# EAGLE board stm32_tracker34 (EAGLE 8.6.3)
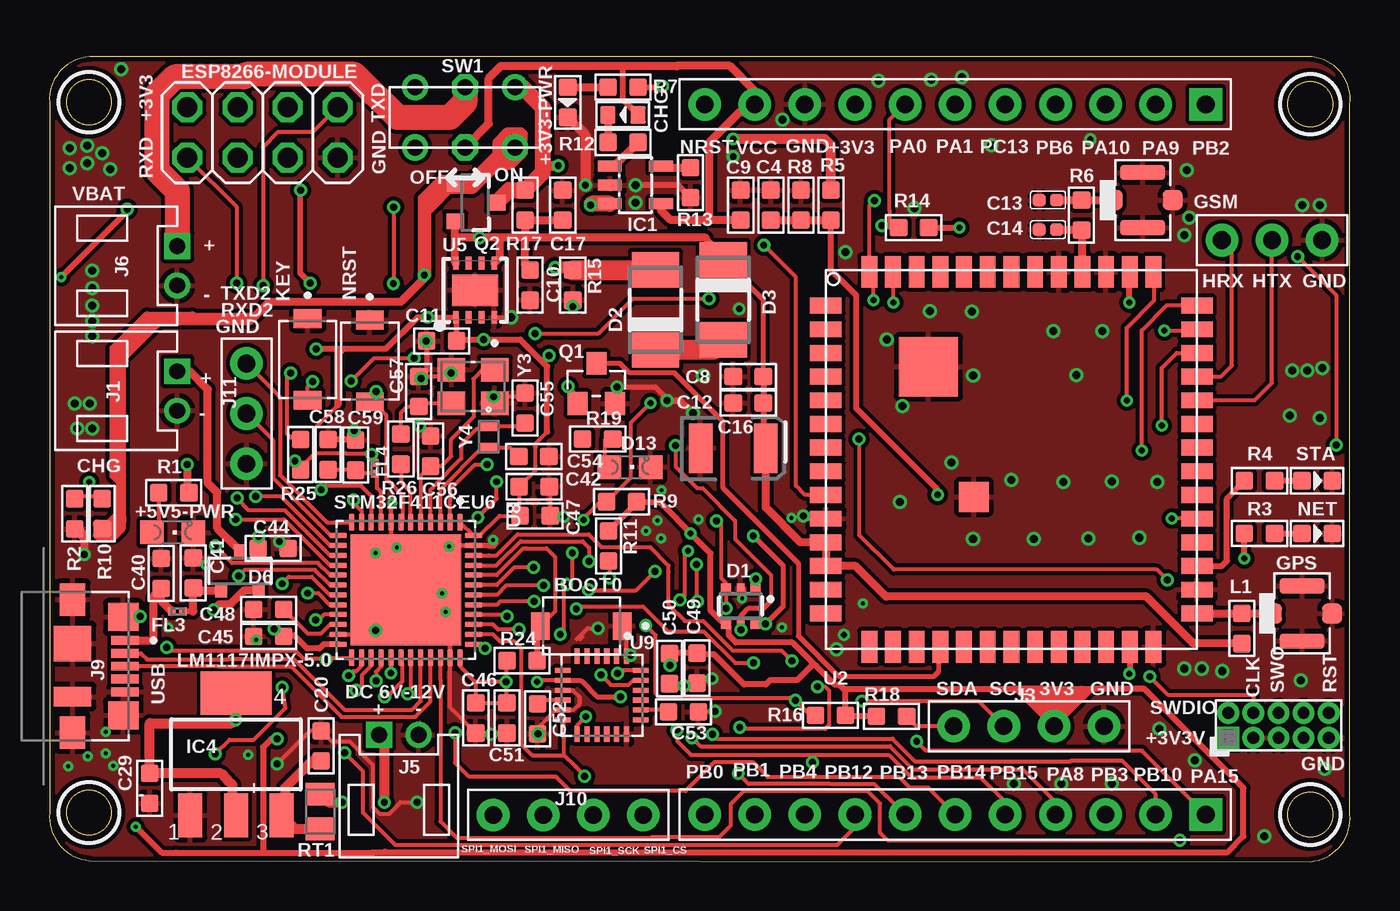
[diagram p1: board, top side]
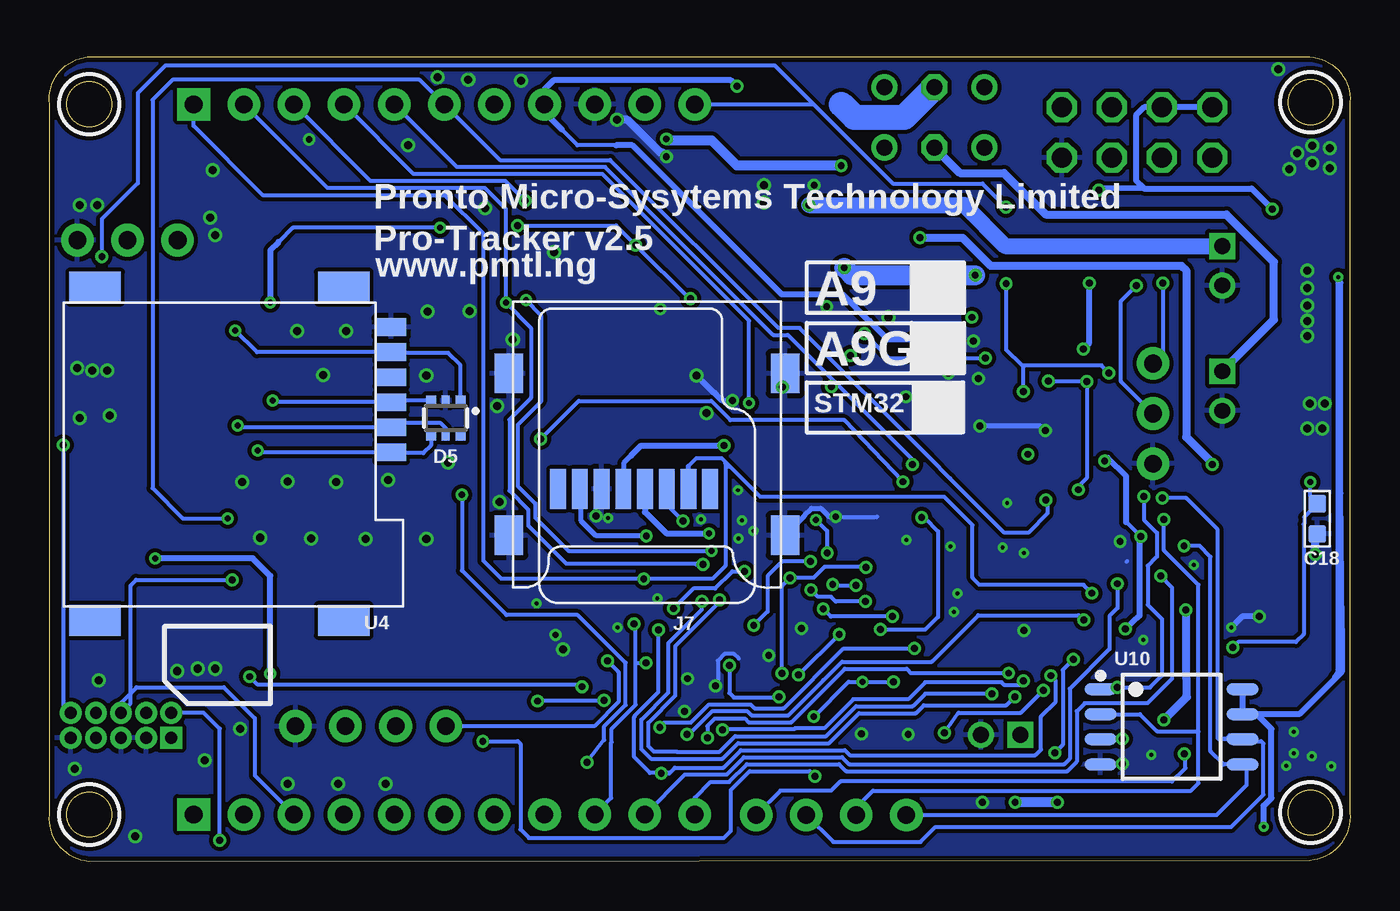
[diagram p2: board, bottom side, seen from below]

Size 65.92 x 40.79 mm. Coordinates in mm from the lower left corner, seen from the top.
Outline: 0.01,38.48 0.01,2.48 arc90 2.03,0.05 63.93,0 arc90 65.91,2.38 65.91,38.38 arc90 64.01,40.79 2.03,40.79 arc90 0.01,38.48
Outline: circle at 63.91,2.38 radius 1.14
Outline: circle at 63.91,38.38 radius 1.14
Outline: circle at 2.01,2.48 radius 1.14
Outline: circle at 2.01,38.48 radius 1.14
Copper layers (1*16): Top 0.035mm / dielectric 1.5mm / Bottom 0.035mm
Design rules "default": minimum track width 6mil, minimum drill 10mil, track to track 6mil, track to pad 6mil, pad to pad 6mil, via to via 6mil, smd to smd 0mil, copper to edge 10mil, drill to drill 10mil, minimum pad ring 10mil, minimum via ring 6mil, stop-mask expansion 2mil, vias tented up to drill 100mil, thermal gap 10mil
Net classes: 0 default: width 0.203 mm, drill 0.305 mm, clearance 0.152 mm; 2 gnd: width 0.305 mm, drill 0.559 mm, clearance 0.254 mm; 3 usbvcc: width 0.508 mm, drill 0.61 mm, clearance 0.254 mm; 4 USBpair: width 0.254 mm, drill 0.406 mm, clearance 0.406 mm
tRestrict: area 62.4,0.9 to 65.4,3.9; area 62.4,36.9 to 65.4,39.9; area 0.5,1 to 3.5,4; area 0.5,37 to 3.5,40
bRestrict: area 62.4,0.9 to 65.4,3.9; area 62.4,36.9 to 65.4,39.9; area 0.5,1 to 3.5,4; area 0.5,37 to 3.5,40

## Footprints (pad centres in the part's own frame; a part is rotated, then mirrored left to right if it is on the bottom)
LED-0603 = smd 0.889 x 0.889: + -0.762,0; - 0.762,0
OPTO_CHIPLED_0805 = smd 1.2 x 1.2: A 0,-1.05; C 0,1.05
SW_TL1015AF160QG = smd 0.95 x 1.4: 1 -2.075,0; 2 2.075,0
C0603 = smd 0.889 x 0.889: 1 -0.762,0; 2 0.762,0
C0402 = smd 0.635 x 0.635: 1 -0.445,0; 2 0.445,0
EIA3528 = smd 1.2 x 2.5: A 1.65,0; C -1.65,0
D0603 = smd 0.762 x 0.889: + -0.762,0; - 0.762,0
PINHEAD_2X05_127 = drill 0.6 pad 1.016 square: 1 -0.635,2.54 | drill 0.6 pad 1.016: 2 0.635,2.54; 3 -0.635,1.27; 4 0.635,1.27; 5 -0.635,0; 6 0.635,0; 7 -0.635,-1.27; 8 0.635,-1.27; 9 -0.635,-2.54; 10 0.635,-2.54
SOT363 = smd 0.5 x 0.5: 1 -0.75,-0.9; 3 0.75,-0.9; 4 0.75,0.9; 6 -0.75,0.9 | smd 0.4 x 0.5: 2 0,-0.9; 5 0,0.9
DO-214AC = smd 1.8 x 2.4: A 2.025,0; C -2.025,0
SOT23-R = smd 0.6 x 0.7: 1 -0.95,-1; 2 0.95,-1; 3 0,1
2X04 = drill 1.016 octagon: 1 -3.81,-1.27; 2 -3.81,1.27; 3 -1.27,-1.27; 4 -1.27,1.27; 5 1.27,-1.27; 6 1.27,1.27; 7 3.81,-1.27; 8 3.81,1.27
BEADC0603X33N = smd 0.38 x 0.4: 1 -0.281,0; 2 0.281,0
4P-U-FL = smd 1.016 x 1.016: D -1.524,0; GND3 1.524,0 | smd 2.286 x 0.762: GND1 0,1.397; GND2 0,-1.397
SOT23-5L = smd 0.55 x 1.2: 1 -0.95,-1.3; 2 0,-1.3; 3 0.95,-1.3; 4 0.95,1.3; 5 -0.95,1.3
INTEGRATEDCIRCUITS_LINEAR_SOT223 = smd 1.219 x 2.235: 1 -2.311,-3.099; 2 0,-3.099; 3 2.311,-3.099 | smd 3.6 x 2.2: 4 0,3.099
PH2.0-2P-90-DIP = drill 0.8 square: 1 0,1 | drill 0.8: 2 0,-1
11P-2.54 = drill 0.889 pad 1.651 square: 1 0,12.7 | drill 0.889 pad 1.651: 2 0,10.16; 3 0,7.62; 4 0,5.08; 5 0,2.54; 6 0,0; 7 0,-2.54; 8 0,-5.08; 9 0,-7.62; 10 0,-10.16; 11 0,-12.7
4P-65/35ROUND = drill 0.889 pad 1.651: 1 0,3.81; 2 0,1.27; 3 0,-1.27; 4 0,-3.81
3P-2.54 = drill 0.9 pad 1.651: 1 0,2.54; 2 0,0; 3 0,-2.54
8P-SMD = smd 0.8 x 2.008: 1 -3.198,0.254; 2 -2.098,0.254; 3 -0.998,0.254; 4 0.102,0.254; 5 1.202,0.254; 6 2.302,0.254; 7 3.402,0.254; 8 4.502,0.254 | smd 1.45 x 2: 9 -7.002,2.6; 10 7.002,2.6; 11 -7.002,-5.598; 12 7.002,-5.598
MOLEX_47346-0001 = smd 0.45 x 1.38: 1 -1.3,2.66; 2 -0.65,2.66; 3 0,2.66; 4 0.65,2.66; 5 1.3,2.66 | smd 1.425 x 1.55: S1 -2.487,2.575; S2 2.487,2.575 | smd 1.65 x 1.3: S3 -3.375,0; S6 3.375,0 | smd 1.8 x 1.9: S4 -1.15,0 | smd 1 x 1.9: S5 1.55,0
L0603 = smd 0.889 x 0.889: 1 -0.762,0; 2 0.762,0
SOT23@1 = smd 1.016 x 1.143: 1 -0.95,-1.016; 2 0.95,-1.016; 3 0,1.016
SOT23-3 = smd 0.8 x 0.9: 1 -0.95,-1; 2 0.95,-1; 3 0,1.1
R0603 = smd 0.889 x 0.889: 1 -0.762,0; 2 0.762,0
THRMC2012X110N = smd 1.15 x 1.47: 1 -0.88,0; 2 0.88,0
6P-2CH-2.54-7.6X3.0 = drill 0.813 pad 1.27: CH1A -1.524,2.54; CH1B -1.524,-2.54; CH2A 1.524,2.54; CH2B 1.524,-2.54 | drill 0.813 pad 1.27 octagon: COM1 -1.524,0; COM2 1.524,0
A9G = smd 1.6 x 0.8: 1 -9.4,7.8; 2 -9.4,6.6; 3 -9.4,5.4; 4 -9.4,4.2; 5 -9.4,3; 6 -9.4,1.8; 7 -9.4,0.6; 8 -9.4,-0.6; 9 -9.4,-1.8; 10 -9.4,-3; 11 -9.4,-4.2; 12 -9.4,-5.4; 13 -9.4,-6.6; 14 -9.4,-7.8; 28 9.4,-7.8; 29 9.4,-6.6; 30 9.4,-5.4; 31 9.4,-4.2; 32 9.4,-3; 33 9.4,-1.8; 34 9.4,-0.6; 35 9.4,0.6; 36 9.4,1.8; 37 9.4,3; 38 9.4,4.2; 39 9.4,5.4; 40 9.4,6.6; 41 9.4,7.8 | smd 0.8 x 1.6: 15 -7.2,-9.5; 16 -6,-9.5; 17 -4.8,-9.5; 18 -3.6,-9.5; 19 -2.4,-9.5; 20 -1.2,-9.5; 21 0,-9.5; 22 1.2,-9.5; 23 2.4,-9.5; 24 3.6,-9.5; 25 4.8,-9.5; 26 6,-9.5; 27 7.2,-9.5; 42 7.2,9.5; 43 6,9.5; 44 4.8,9.5; 45 3.6,9.5; 46 2.4,9.5; 47 1.2,9.5; 48 0,9.5; 49 -1.2,9.5; 50 -2.4,9.5; 51 -3.6,9.5; 52 -4.8,9.5; 53 -6,9.5; 54 -7.2,9.5 | smd 3 x 3: 55 -4.2,4.7 | smd 1.5 x 1.5: 56 -1.9,-1.9
MICROSIM = smd 1.5 x 0.9: 1 -0.8,2.5; 2 -0.8,5.04; 3 -0.8,7.58; 5 -0.8,1.23; 6 -0.8,3.77; 7 -0.8,6.31 | smd 2.61 x 1.56: P$1 1.6,-0.8; P$2 14.2,-0.8; P$3 14.2,16.1; P$4 1.6,16.1
8-UDFN = smd 0.3 x 0.65: 1 -0.975,-1.375; 2 -0.325,-1.375; 3 0.325,-1.375; 4 0.975,-1.375; 5 0.975,1.375; 6 0.325,1.375; 7 -0.325,1.375; 8 -0.975,1.375 | smd 2.35 x 1.6: EP 0,0
QFN50P700X700X60-49N = smd 0.87 x 0.27: 1 -3.43,2.75; 2 -3.43,2.25; 3 -3.43,1.75; 4 -3.43,1.25; 5 -3.43,0.75; 6 -3.43,0.25; 7 -3.43,-0.25; 8 -3.43,-0.75; 9 -3.43,-1.25; 10 -3.43,-1.75; 11 -3.43,-2.25; 12 -3.43,-2.75; 25 3.43,-2.75; 26 3.43,-2.25; 27 3.43,-1.75; 28 3.43,-1.25; 29 3.43,-0.75; 30 3.43,-0.25; 31 3.43,0.25; 32 3.43,0.75; 33 3.43,1.25; 34 3.43,1.75; 35 3.43,2.25; 36 3.43,2.75 | smd 0.27 x 0.87: 13 -2.75,-3.43; 14 -2.25,-3.43; 15 -1.75,-3.43; 16 -1.25,-3.43; 17 -0.75,-3.43; 18 -0.25,-3.43; 19 0.25,-3.43; 20 0.75,-3.43; 21 1.25,-3.43; 22 1.75,-3.43; 23 2.25,-3.43; 24 2.75,-3.43; 37 2.75,3.43; 38 2.25,3.43; 39 1.75,3.43; 40 1.25,3.43; 41 0.75,3.43; 42 0.25,3.43; 43 -0.25,3.43; 44 -0.75,3.43; 45 -1.25,3.43; 46 -1.75,3.43; 47 -2.25,3.43; 48 -2.75,3.43 | smd 5.6 x 5.6: 49 0,0
QFN50P400X400X95-24N = smd 0.79 x 0.26: 1 -1.97,1.25; 2 -1.97,0.75; 3 -1.97,0.25; 4 -1.97,-0.25; 5 -1.97,-0.75; 6 -1.97,-1.25; 13 1.97,-1.25; 14 1.97,-0.75; 15 1.97,-0.25; 16 1.97,0.25; 17 1.97,0.75; 18 1.97,1.25 | smd 0.26 x 0.79: 7 -1.25,-1.97; 8 -0.75,-1.97; 9 -0.25,-1.97; 10 0.25,-1.97; 11 0.75,-1.97; 12 1.25,-1.97; 19 1.25,1.97; 20 0.75,1.97; 21 0.25,1.97; 22 -0.25,1.97; 23 -0.75,1.97; 24 -1.25,1.97
SOIC127P790X216-8N = smd 1.6 x 0.6: 1 -3.6,1.905; 2 -3.6,0.635; 3 -3.6,-0.635; 4 -3.6,-1.905; 5 3.6,-1.905; 6 3.6,-0.635; 7 3.6,0.635; 8 3.6,1.905
XTAL_7M25072001 = smd 1.2 x 1.4: 1 -0.85,1.1; 2 -0.85,-1.1; 3 0.85,-1.1; 4 0.85,1.1
XTAL160X100X50 = smd 0.5 x 1: 1 -0.55,0; 2 0.55,0

## Placement (x,y rotation side)
+3V3-PWR  RED  [LED-0603]  26.27,38.48 270 top
+5V5-PWR  RED  [OPTO_CHIPLED_0805]  6.26,16.69 270 top
BOOT0  TL1015AF160QG  [SW_TL1015AF160QG]  26.96,11.94 180 top
C4  0.1uF  [C0603]  36.56,33.27 90 top
C8  10uF  [C0603]  35.42,24.59 0 top
C9  10u  [C0603]  35.04,33.27 270 top
C10  4.7uF  [C0603]  24.37,29.21 90 top
C11  4.7uF  [C0603]  19.87,26.39 0 top
C12  1uF  [C0603]  35.42,23.24 0 top
C13  NC  [C0402]  50.61,33.53 0 top
C14  NC  [C0402]  50.61,32.03 0 top
C16  100uF  [EIA3528]  34.65,20.96 0 top
C17  10uF  [C0603]  26.02,33.27 270 top
C18  0.1uF  [C0603]  1.66,17.37 270 bottom
C20  100nF  [C0603]  13.78,5.87 270 top
C29  100nF  [C0603]  5.09,3.71 270 top
C40  100nF  [C0603]  5.67,14.61 270 top
C41  100nF  [C0603]  7.3,14.63 270 top
C42  2.2uF  [C0603]  24.57,19 180 top
C44  100nF  [C0603]  11.34,15.86 180 top
C45  100nF  [C0603]  11.11,11.4 0 top
C46  100nF  [C0603]  21.61,7.28 90 top
C47  100nF  [C0603]  24.62,17.53 180 top
C48  2.2uF  [C0603]  11.11,12.78 0 top
C49  100nF  [C0603]  32.83,9.8 90 top
C50  100nF  [C0603]  31.43,9.78 90 top
C51  100nF  [C0603]  23.19,7.28 90 top
C52  0.1uf  [C0603]  24.74,7.24 90 top
C53  220pf  [C0603]  32.14,7.59 180 top
C54  4.3pf  [C0603]  24.55,20.52 180 top
C55  4.3pf  [C0603]  24.11,22.99 270 top
C56  12pf  [C0603]  19.31,20.8 270 top
C57  12pf  [C0603]  18.72,23.83 270 top
C58  100nF  [C0603]  14.13,20.62 270 top
C59  100nF  [C0603]  15.53,20.6 270 top
CHG  ORANGE  [D0603]  29.07,37.85 180 top
CN2  PINHEAD-2x5-P1.27  [PINHEAD_2X05_127]  62.29,6.91 90 top
D1  SMF05C  [SOT363]  35.04,12.95 180 top
D2  S2M  [DO-214AC]  30.72,27.97 90 top
D3  SS34  [DO-214AC]  34.15,28.47 270 top
D5  SMF05C  [SOT363]  45.83,22.48 180 bottom
D6  BAT54C  [SOT23-R]  9.66,14.73 0 top
D13  Yellow  [OPTO_CHIPLED_0805]  29.42,19.99 270 top
ESP8266-MODULE  [2X04]  10.8,36.96 0 top
FL3  BLM03AG100SZ1D  [BEADC0603X33N]  6.49,12.67 0 top
FL4  BLM03AG100SZ1D  [BEADC0603X33N]  16.49,19.94 270 top
GPS  [4P-U-FL]  63.48,12.57 0 top
GSM  [4P-U-FL]  55.41,33.53 0 top
IC1  MCP73831/OT  [SOT23-5L]  29.7,34.29 270 top
IC4  LM1117IMPX-5.0  [INTEGRATEDCIRCUITS_LINEAR_SOT223]  9.46,5.44 0 top
J1  PH2.0-2P-90-DIP  [PH2.0-2P-90-DIP]  6.49,23.85 0 top
J2  [11P-2.54]  45.91,38.38 270 top
J3  [4P-65/35ROUND]  49.64,6.86 90 top
J4  [3P-2.54]  61.96,31.5 90 top
J5  PH2.0-2P-90-DIP  [PH2.0-2P-90-DIP]  17.71,6.43 90 top
J6  PH2.0-2P-90-DIP  [PH2.0-2P-90-DIP]  6.49,30.2 0 top
J7  [8P-SMD]  35.63,19.14 180 bottom
J8  [11P-2.54]  45.91,2.38 270 top
J9  47346-0001  [MOLEX_47346-0001]  1.18,9.91 270 top
J10  [4P-65/35ROUND]  26.3,2.36 270 top
J11  [3P-2.54]  9.99,22.71 0 top
KEY  TL1015AF160QG  [SW_TL1015AF160QG]  13.09,25.45 270 top
L1  82nH  [L0603]  60.44,11.81 270 top
NET  Blue  [LED-0603]  64.25,16.64 0 top
NRST  TL1015AF160QG  [SW_TL1015AF160QG]  16.24,25.37 270 top
Q1  BSN20  [SOT23@1]  27.72,24.23 0 top
Q2  MOSFET-PCHANNEL  [SOT23-3]  21.57,33.4 270 top
R1  1K  [R0603]  6.31,18.69 0 top
R2  1M  [R0603]  1.28,17.63 90 top
R3  330R  [R0603]  61.32,16.64 0 top
R4  330R  [R0603]  61.32,19.3 0 top
R5  1M/1%  [R0603]  39.61,33.27 90 top
R6  0R  [R0603]  52.31,32.77 90 top
R7  1K  [R0603]  29.07,39.24 180 top
R8  1M/1%  [R0603]  38.08,33.27 270 top
R9  2k2  [R0603]  28.99,18.24 180 top
R10  1M  [R0603]  2.68,17.63 270 top
R11  2k2  [R0603]  28.33,16 270 top
R12  1k  [R0603]  29.07,36.45 0 top
R13  2k  [R0603]  32.5,34.42 270 top
R14  10k  [R0603]  43.8,32.13 0 top
R15  100k  [R0603]  26.53,29.21 270 top
R16  2k2  [R0603]  39.58,7.42 180 top
R17  NC  [R0603]  24.11,33.27 270 top
R18  2k2  [R0603]  42.68,7.37 0 top
R19  1K  [R0603]  27.79,21.41 180 top
R24  1K  [R0603]  23.96,10.19 0 top
R25  1K  [R0603]  12.73,20.62 90 top
R26  0R  [R0603]  17.81,20.9 90 top
RT1  PRG21BC1R0MM1RA  [THRMC2012X110N]  13.73,2.54 90 top
STA  green  [LED-0603]  64.25,19.3 0 top
SW1  [6P-2CH-2.54-7.6X3.0]  21.07,37.72 270 top
U2  [A9G]  48.75,20.38 0 top
U4  MICROSIM  [MICROSIM]  49.4,28.32 180 bottom
U5  AP7361C-33FGE  [8-UDFN]  21.57,28.96 0 top
U8  STM32F411CEU6  [QFN50P700X700X60-49N]  18.07,13.77 270 top
U9  MPU-6050  [QFN50P400X400X95-24N]  28,8.43 270 top
U10  W25Q32JVSSIQ  [SOIC127P790X216-8N]  9.05,6.83 0 bottom
Y3  7M25072001  [XTAL_7M25072001]  21.47,24.08 270 top
Y4  32.768KHZ  [XTAL160X100X50]  22.27,21.53 270 top

## Tracks (layer width: path | path; a pad name or v marks a point on that pad's centre or on a via)
+3V3  (via drill 0.2, 0.3, 0.35)
  Top 0.203: 29.75,18.16 29.64,18.05 29.61,18.05 R11.1 | 29.75,18.16 29.96,18.16 31,18.16 31.11,18.05 | 29.75,18.16 R9.1 | C50.2 31.43,9.97 v31.45,9.94 | v28.94,8.36 28.94,8.1 | 23.02,8.04 C46.2 21.61,9.09 | 23.02,8.04 C51.2 | 23.15,10.18 23.08,10.25 | 22.9,10.34 23.05,10.34 R24.1 23.15,10.13 v23.15,9.12 | v23.15,9.12 23.15,8.17 23.02,8.04 | v23.15,9.12 21.63,9.12 21.61,9.09 | 21.61,9.09 20.82,9.89 U8.36 | 12.39,11.48 11.95,11.48 C45.2 | 24.62,21.01 24.64,21.04 | 24.62,21.01 24.62,19.81 C42.2 23.81,17.48 C47.2 22.81,17.53 21.8,16.52 U8.48 U8.1 | 24.62,21.01 24.62,21.17 25.23,21.78 | U9.13 26.75,6.91 v27.18,7.35 | U9.8 24.78,9.18 v24.72,9.12 | 38.86,9.92 38.62,9.92 | v16.34,20.64 16.35,20.65 16.36,20.66 15.04,20.66 15.02,20.69 13.45,20.69 | 13.45,20.69 13.45,20.89 13.43,20.9 13.43,21.94 14.59,23.1 | 13.45,20.69 12.73,19.98 R25.1 12.73,20.01 v12.44,20.3
  Top 0.254: U9.8 26.94,9.18 27.77,8.36 v28.94,8.36
  Top 0.279: C11.2 20.63,27.55 U5.1 v19.16,27.58 | v13.22,29.31 12.71,29.82 12.71,34.04 v12.73,34.04
  Top 0.305: 40.24,8.76 49.01,8.76 | 49.01,8.76 49.26,8.76 | 50.91,8.76 52.31,8.76 | 52.31,8.76 52.82,8.76 | J3.3 50.91,8.76 | 50.91,8.76 49.26,8.76 | 49.26,8.76 49.26,8.51 | 49.26,8.51 J3.3 | J3.3 52.31,8.25 | 52.31,8.25 52.31,8.64 | 52.31,8.76 52.31,8.64 | 52.31,8.64 51.04,7.37 50.91,7.37 50.78,7.24 50.78,7.37 49.51,8.64 51.93,8.64 52.05,8.51 51.8,8.51 51.04,7.75 50.66,7.75 50.66,7.87 50.02,8.51 51.42,8.51 51.55,8.38 51.42,8.38 51.29,8.25 | 51.29,8.25 51.04,8 50.78,8 50.4,8.38 51.16,8.38 51.29,8.25 | 52.82,8.76 52.31,8.25 | 49.01,8.76 49.26,8.51 | 58.83,5.41 60.51,3.73 60.51,1.27 59.69,0.45 17.05,0.45 | 58.83,5.41 55.48,8.76 52.82,8.76 | v19.16,27.58 18.65,27.58 17.05,25.98 14.89,25.98 | 14.89,25.98 14.59,25.98 | 14.59,25.98 v13.52,25.98 | v11.55,6.21 11.24,6.2 10.83,5.79 10.83,0.48 10.8,0.45 | U8.24 13.91,11.02 13.69,10.8 13.06,10.8 12.39,11.48 | R25.1 12.76,19.84 | C50.2 31.45,10.57 C49.2 32.88,10.52 33.66,10.52 35.21,8.97 36.31,8.97 36.53,9.19 37.89,9.19 38.62,9.92 | 40.24,8.76 40.34,8.66 R16.1 40.39,7.37 R18.1 | C11.2 20.71,26.47 v22.01,26.47 23.86,26.47 25,25.32 | R7.1 31.02,39.24 v31.07,39.29 | 23.08,10.25 R24.1 | CN2.1 58.89,5.41 58.83,5.41 | 40.24,8.76 40.04,8.97 39.81,8.97 38.86,9.92 37.67,11.11 34.79,11.11 34.42,11.48 34.42,11.92 D1.4 34.15,12.19 34.04,12.19 33.51,12.72 33.51,15.62 v32.5,16.64 32.5,16.66 31.11,18.05 30.92,18.24 R9.1 | v3.95,33.07 3.95,32.97 v0.59,29.62 | C45.2 11.4,11.87 v11.4,11.8 | C44.2 10.58,16.44 v10.61,16.48 | 14.89,25.98 14.66,25.76 14.66,23.18 14.59,23.1 14.59,25.98 | 25.23,21.78 25.23,25.09 25,25.32 | R11.1 29.73,18.16 29.96,18.16 | 25,25.32 v25.32,25.65 | 17.05,0.45 16.49,0.45
  Top 0.305: 16.49,0.45 16.34,0.45 | 17.05,0.45 17,0.5 | 10.8,0.45 6.41,0.45 5.7,0.45 v4.38,1.77 | 10.8,0.45 16.49,0.45 | FL4.1 16.35,20.36 16.35,20.65
  Bottom 0.203: v31.45,9.94 31.45,8.55 31.23,8.32 28.98,8.32 v28.94,8.36 | 39.95,37.1 39.16,36.31 37.19,36.31 | 10.67,16.53 11.34,17.21 11.35,17.21 | v27.18,7.35 25.41,9.12 v24.72,9.12 v23.15,9.12
  Bottom 0.254: 35.8,18.82 J7.4 | v12.44,20.3 12.29,20.45 12.29,20.46
  Bottom 0.279: v12.73,34.04 12.65,34.12 10.46,34.12
  Bottom 0.305: J7.4 35.73,17.72 34.65,16.64 v32.5,16.64 | v3.95,33.07 4.99,34.11 10.45,34.11 10.46,34.12 10.85,34.52 10.85,37.82 10.45,38.23 ESP8266-MODULE.4 ESP8266-MODULE.2 | 0.43,11.81 0.42,9.9 0.76,9.35 | 0.43,11.81 0.49,18.67 0.49,29.34 0.59,29.44 v0.59,29.62 0.59,9.45 | v13.52,25.98 13.22,26.29 v13.22,29.31 | U10.8 U10.7 4.78,7.47 4.76,7.49 | U10.3 v11.55,6.21 | v22.01,26.47 23.42,26.47 24.36,27.4 24.39,27.4 25.74,28.75 28.81,28.75 36.37,36.31 37.19,36.31 | v31.07,39.29 31.38,39.6 40.37,39.6 40.83,39.14 J2.8 40.83,37.97 39.95,37.1 | v4.38,1.77 4.38,2.83 3.99,3.22 3.99,6.73 4.76,7.49 | 4.76,7.49 2.55,7.49 0.59,9.45 | 0.43,11.81 0.43,9.61 0.59,9.45 | v11.4,11.8 10.67,12.47 10.67,16.53 v10.61,16.48 | 12.29,20.46 11.35,19.52 11.35,17.21
+5V  (via drill 0.35)
  Top 0.406: v8.32,12.75 8.6,13.03 9.16,13.03 9.86,13.73 D6.2
  Top 0.508: IC4.4 9.46,7.21 v9.43,7.19 9.26,7.01 5.09,7.01 C29.1 8.7,4.47 9.02,4.15 9.28,3.89 9.28,2.51 IC4.2
  Bottom 0.406: v9.43,7.19 8.27,8.34 8.31,8.38 8.31,9.32 8.32,9.34 v8.32,12.75
A9_RESET
  Top 0.254: U2.18 45.07,10.8 45.07,9.65 44.81,9.4 39.99,9.4 37.96,11.43 37.96,15.11 34.15,18.92 34.15,22.3 31.69,24.76 29.4,24.76 28.92,25.25 Q1.3
BOOT0
  Top 0.203: 25.16,11.66 BOOT0.2 25.63,12.69 25.63,15.43 25.19,15.88 24.17,15.88 24.16,15.86 24.02,15.86 22.67,14.52 U8.44
  Top 0.305: BOOT0.2 24.72,11.78 R24.2
CPOUT
  Top 0.203: C53.2 31.29,7.68 U9.20
GND  (via drill 0.2, 0.3, 0.35, 0.41)
  Top 0.127: v27.81,11.82 27.87,11.89
  Top 0.203: Q1.2 28.67,23.96 v28.76,24.06 | 24.06,23.67 C55.1 23.92,23.56 v22.51,23.56 | 18.91,24.74 19.08,24.92 19.08,24.79 C57.1 | 29.22,11.63 29.22,10.52 U9.1 29.36,10.45 v29.46,10.45 | U8.8 17.31,17.27 17.31,18.11 v17.38,18.19 17.32,18.12 U8.8 | 17.31,17.09 U8.8 | C44.1 11.98,16.22 v11.66,16.22 | 10.16,12.72 10.23,12.79 | v18.63,3.01 17.8,3.01 17.22,2.43 16.74,2.43 16.39,2.77 16.39,4.91 15.21,6.09 14.31,6.09 C20.1 13.22,6.63 v11.54,4.95 | v32.17,8.9 32.68,8.9 C49.1 33.05,9.27 v33.59,9.27 | U8.49 18.96,13.77 | 19.72,13.77 v19.9,13.59 | U8.49 17.31,14.53 | U8.49 18.07,13.95 | 20.32,16.02 22.53,16.02 22.64,16.13 v22.49,16.3 | v26.07,17.48 26.02,17.53 C47.1 25.38,18.95 C42.1 | U8.8 17.32,16.22 v17.61,15.93 | C53.1 32.92,7.61 v33.74,7.61 | 28.96,11.38 29.22,11.63 | BOOT0.1 29.03,11.82 29.22,11.63 | 27.01,11.38 26.91,11.28 | Y3.2 20.03,24.59 C57.1 | v23.4,27.58 U5.4 | 20.37,25.13 v20.37,24.75 | C57.1 18.88,24.66 19.11,24.89 | 26.74,11.28 27.28,11.82 v27.81,11.82 | 22.4,6.52 C46.1 20.44,7.68 20.43,7.68 20.32,7.8 U8.35 20.32,12.41 v20.07,12.65 | 22.4,6.52 C51.1 | v22.4,6.45 22.4,6.52 | U8.49 20.1,15.8 | U8.49 17.38,13.08 16.62,13.08 | U8.49 16.53,15.3 v16.53,15.65 | U8.23 16.33,11.52 v16.53,11.71 | U8.49 19.16,12.68 19.16,12.61 | U8.49 16.75,12.45 15.67,12.45 | 26.88,7.99 26.88,8 | v24.76,6.46 24.76,6.78 25.38,7.4 25.38,7.42 25.65,7.68 U9.11 26.56,7.68 26.88,8 | 26.88,8 26.88,8.32 26.52,8.68 U9.9
  Top 0.254: U2.10 38.36,17.38 v38.21,17.53 | C45.1 10.55,11.2 v10.49,11.23 | v28.76,24.06 30.71,24.06 31.4,23.37 | Y3.4 22.57,23.46 | C11.1 19.11,24.89 19.11,24.82 | C59.1 15.45,21.44 v15.45,21.85
  Top 0.279: U8.47 22.53,16.02
  Top 0.305: v29.7,34.29 31.86,34.29 R13.2 | J9.S1 4.59,12.39 v4.61,12.42 | C59.1 15.5,21.39 C58.1 | C56.1 18.8,22.07 v18.75,22.07 | R15.2 v26.53,28.12 | v31.3,23.37 31.4,23.37 31.98,23.37 v32.62,22.73
  Top 0.406: D1.2 35.11,13.78 v35.11,13.34 | 1.76,16.56 1.46,16.87 R2.1 1.78,16.37 v1.78,15.57
  Top 0.508: +3V3-PWR.- 27.16,36.83 v27.16,34.29
  Bottom 0.203: v28.76,24.06 28.76,24.6 J7.11 | 30.98,10.29 31.21,10.52 31.69,10.52 32.04,10.18 32.04,9.03 v32.17,8.9 | v26.07,17.48 23.96,17.48 | v11.54,4.95 12.63,4.95 U10.4 | 11.33,15.2 11.3,15.23
  Bottom 0.254: v15.45,21.85 15.68,22.07 v18.75,22.07 | v26.07,17.48 26.39,17.48 26.82,17.91 27.3,17.91 27.64,17.57 27.64,17.52 J7.9
  Bottom 0.305: v4.61,12.42 5.47,12.42 v6.03,11.86 | v33.13,24.64 32.24,23.75 32.2,23.75 31.82,23.37 v31.3,23.37
  Bottom 0.406: v1.78,15.57 1.78,16.49 C18.2 | v34.65,35.74 34.86,35.94 34.98,35.94 36.63,37.59 v37.14,37.59
  other vias: 2.17,27.41 62.85,22.61 2.17,29.06 64.37,22.48 2.17,26.64 2.17,28.17 1.41,21.95 2.17,21.95 3.08,35.1 3.64,40.16 1.28,23.22 2.04,23.22 52.66,16.38 58.4,9.78 56.24,6.73 57.51,9.78 53.83,3.94 51.29,3.94 48.88,3.94 64.63,4.7 58.05,5.13 47.74,36.32 44.69,39.62 46.24,39.75 48.75,19.34 49.89,16.35 50.88,26.89 46.82,24.64 43.1,18.22 39.89,10.74 63.41,9.19 59.45,9.65 52.77,36.6 46.82,16.35 53.83,19.27 52.05,24.67 53.36,26.89 43.85,33.12 42.43,26.45 45.7,20.22 64.37,33.27 63.48,33.27 57.51,31.75 57.77,32.64 57.64,35.05 61.58,1.27 2.17,29.95 29.7,33.4 1.91,36.3 1.03,35.15 1.03,36.17 2.68,35.92 1.91,35.41 42.02,39.57 44.62,27.91 46.75,27.88 55.23,16.41 43.23,23.08 40.27,11.48 62.98,24.89 63.74,24.89 64.5,25.02 40.34,30.89 34.96,28.02 20.26,15.98 37.12,11.86 41.23,13.08 30.82,17.3 31.02,18.82 31,16.38 30.24,16.76 32.9,17.35 37.6,17.42 2.85,5.49 1.94,5.33 3.24,4.85 2.85,6.58 0.95,4.83 7.93,15.04 18.84,24.48 10.07,5.41 19.08,26.38 56.15,19.24 51.39,19.24
  pour Bottom (isolate 0.203): -1.26,-0.79 70.91,-0.89 70.91,45.38 -1.26,45.48
  pour Top (isolate 0.203): -1.26,-0.79 70.91,-0.89 70.91,45.38 -1.26,45.48
GPS_RF
  Top 0.406: U2.28 L1.1 GPS.D
GSM_RF
  Top 0.406: U2.45 52.35,31.96 R6.1 51.08,32 C14.2
HRXD
  Top 0.203: U2.38 59.36,24.58 59.93,25.15 59.93,30.99 J4.1
HSE_OCS_OUT
  Top 0.203: R26.1 17.84,20.12 17.84,19.2 18.32,18.72 U8.6
HSE_OSC_IN
  Top 0.203: Y3.1 21.97,24.93 21.5,24.46 21.5,22.53 20.37,21.4 20.37,20.54 19.87,20.04 C56.2 18.82,19.55 U8.5
HSE_OUT
  Top 0.203: R26.2 17.81,22.76 18.12,23.06 C57.2 19.05,23.23 Y3.3
HTXD
  Top 0.203: U2.37 61.08,23.38 61.96,24.26 J4.2
IO27  (via drill 0.3)
  Top 0.305: U2.26 54.75,9.56 v54.72,9.53 | v60.56,15.37 R3.1
  Bottom 0.305: v54.72,9.53 54.72,14.48 55.61,15.37 v60.56,15.37
IO28
  Top 0.305: U2.30 59.41,14.98 59.67,15.24 59.67,18.41 R4.1
LSE_OSC_IN
  Top 0.203: U8.3 19.82,18.86 21.93,20.98 Y4.2 23.34,20.98 C54.2
LSE_OSC_OUT
  Top 0.203: U8.4 19.32,18.85 19.46,18.99 19.46,19.01 20.87,20.42 20.87,21.14 21.65,21.92 Y4.1 23.96,22.08 C55.2
MCU_VCAP1
  Top 0.203: U8.22 14.23,12.02 13.75,11.54 13.11,11.54 C48.2
N$1
  Top 0.305: R4.2 STA.+
N$2
  Top 1.016: D2.C 33.64,25.94 D3.A
N$3
  Top 0.406: +3V3-PWR.+ R7.2
N$4  (via drill 0.35)
  Top 0.508: RT1.2 14.13,3.01 v14.84,3.01 | J5.1 16.98,6.16 v16.98,3.01
  Bottom 0.508: v14.84,3.01 v16.98,3.01
N$5
  Top 0.203: R1.1 5.55,17.03 +5V5-PWR.A
N$6
  Top 0.508: 11.95,2.16 IC4.3 11.77,2.82 11.95,3 | 11.95,2.16 12.45,1.66 RT1.1 | 11.95,3 11.95,3.73 13.32,5.11 C20.2 | 11.95,3 11.95,2.16
N$7
  Top 0.305: R3.2 NET.+
N$16
  Top 0.203: R19.1 28.15,21.36 28.15,20.3 28.33,20.12 D13.A
N$25
  Top 0.406: CHG.- R12.1
N$26
  Top 0.406: IC1.1 28.62,35.24 R12.2
N$31
  Top 0.406: IC1.5 30.78,35.24 30.72,35.18 R13.1
N$94
  Top 0.406: C13.2 R6.2 GSM.D
NRST  (via drill 0.35)
  Top 0.203: U8.7 17.92,17.29 17.92,18.54 17.08,19.38 17.08,22.61 16.78,22.91 16.78,23.16 16.38,23.16 NRST.2 | 12.73,21.67 R25.2 12.63,21.49 12.25,21.49 12.05,21.69 12.05,24.59 v12.23,24.77 | v17.44,33.18 v17.43,33.17 v17.43,29.29 | v63.25,30.66 65.21,28.7 v65.21,21.11 | NRST.2 16.42,23.48 | v16.56,23.83 16.24,23.67 NRST.2
  Bottom 0.203: v17.44,33.18 18.63,34.37 23.17,34.37 27.19,38.38 | v17.43,29.29 17.43,25.96 16.62,25.15 | v65.21,21.11 65.21,7.92 CN2.10 | v63.25,30.66 63.25,32.56 61.44,34.38 61.44,38.95 60.03,40.36 29.17,40.36 27.19,38.38 | v12.23,24.77 12.61,25.15 16.62,25.15 | J2.11 27.19,38.38 | v16.56,23.83 16.56,25.08 16.62,25.15
PA0  (via drill 0.35)
  Top 0.203: 16.29,17.23 U8.10 16.32,18.54 15.79,19.07 14,19.07 v13.77,18.85 | U2.9 38.3,18.58 37.83,19.05 37.83,29.62 v36.2,31.24 | 42.91,32.13 42.58,32.13 42.58,33 42.55,33.02 42.55,37.57 J2.7 | 42.91,32.13 R14.1 | v42.2,32.23 42.81,32.23 42.91,32.13 | v33.44,28.52 29.57,28.52 27.82,26.77 v24.62,26.77 | KEY.2 13.09,24.08 v13.34,24.33 | v15.3,24.36 16.45,25.51 v18.47,25.51
  Bottom 0.203: v42.2,32.23 37.19,32.23 v36.2,31.24 33.49,28.52 v33.44,28.52 | 13.34,24.16 v13.34,24.33 | v18.47,25.51 23.36,25.51 v24.62,26.77 | v15.3,24.36 13.55,24.36 13.34,24.16 | 13.34,24.16 13.34,19.43 13.77,19.01 v13.77,18.85
PA1  (via drill 0.3, 0.35)
  Top 0.203: U2.32 56.9,17.38 v56.88,17.4 | 15.34,18.25 15.82,17.77 15.82,17.48
  Top 0.254: 15.82,17.48 U8.11 | v15.41,18.33 15.34,18.25
  Bottom 0.203: v56.88,17.4 59.17,17.4 60.69,18.92 60.69,38.61 59.67,39.62 47.15,39.62 J2.6 43.08,35.56 37.49,35.56 28.98,27.05 27.9,27.05 21.31,20.46 20.27,19.43 17.51,16.66 16.32,16.66 15.32,17.66 15.32,18.24 v15.41,18.33
PA2/TXD2  (via drill 0.35)
  Top 0.203: ESP8266-MODULE.1 9.48,33.2 v9.48,29.31 | J11.1 11.69,23.55 11.69,19.59 14.09,17.2 U8.12
  Bottom 0.203: v9.48,29.31 9.48,25.76 J11.1
PA3/RXD2  (via drill 0.35)
  Top 0.203: ESP8266-MODULE.8 13.34,36.96 11.57,36.96 10.83,36.22 v10.83,29.18 | J11.2 11.34,21.36 11.34,19.44 14.26,16.52 U8.13
  Bottom 0.203: v10.83,29.18 11.62,28.4 11.62,24.33 J11.2
PA4/FCS  (via drill 0.35)
  Top 0.203: v8.41,5.46 9.13,6.18 10.36,6.18 11.97,7.78 v11.81,8.82 | U8.14 14.23,16.02 11.75,18.5 v10.45,18.5
  Bottom 0.203: v11.81,8.82 11.92,8.74 12.04,8.74 | 12.2,8.74 12.04,8.74 | 12.04,8.74 v11.81,8.82 | U10.1 12.2,8.74 | 12.02,8.56 12.2,8.74 | J10.1 28.88,3.59 26.3,3.59 25.83,4.06 9.03,4.06 8.35,4.74 8.35,5.4 v8.41,5.46 | v10.45,18.5 10.45,17.32 9.79,16.66 9.79,15.45 10.26,14.99 10.26,13.02 9.53,12.29 9.53,9.43 10.14,8.82 v11.81,8.82
PA5/SCK1  (via drill 0.35)
  Top 0.203: U8.15 14.23,15.52 11.92,17.82 10.09,17.82 9.51,18.4 v9.51,18.43
  Bottom 0.203: J10.2 26.2,0.99 21.78,0.99 21.01,1.75 6.03,1.75 4.4,3.38 4.4,5.99 4.5,6.1 5.8,6.1 5.9,6.2 | 5.95,6.25 6.1,6.4 6.28,6.22 | U10.6 5.9,6.2 | U10.6 6.66,6.2 6.71,6.25 | 6.71,6.25 5.95,6.25 | 5.95,6.25 5.9,6.2 | U10.6 5.5,6.25 5.95,6.25 | v9.51,18.43 8.31,18.43 6.71,16.83 6.71,6.25
PA6/MISO1  (via drill 0.35)
  Top 0.203: U8.16 14.22,15.02 11.89,17.35 v9.44,17.35
  Bottom 0.203: J10.3 25.03,2.74 24.18,3.59 8.07,3.59 7.69,3.97 7.69,6.58 | 7.69,6.58 7.69,14.03 9.44,15.78 v9.44,17.35 | 7.69,6.58 7.72,6.6 9.79,6.6 10.65,7.47 U10.2
PA7/MOSI1  (via drill 0.35)
  Top 0.203: v8.42,16 8.42,15.96 9.26,15.13 11.38,15.13 11.39,15.14 13.6,15.14 14.22,14.52 U8.17
  Bottom 0.203: J10.4 6.77,2.36 5.24,3.89 5.24,4.72 U10.5 6.41,4.93 7.08,5.59 7.08,15.45 7.63,16 v8.42,16
PA8/SCL3  (via drill 0.35)
  Top 0.203: J8.4 50.99,3.02 49.33,4.67 43.77,4.67 42.6,5.84 33,5.84 v32.57,6.27 | v17.31,9.55 17.32,9.56 U8.29
  Bottom 0.203: v32.57,6.27 32.57,6.39 32.57,6.87 32.2,7.25 30.68,7.25 30.49,7.06 28.31,7.06 25.6,9.77 22.47,9.77 22.25,9.55 v17.31,9.55
PA9/TXD1  (via drill 0.3, 0.35)
  Top 0.203: v42.78,28.32 42.78,29.85 U2.53 | U8.30 17.82,10.06 17.89,10 17.89,9.13 17.11,8.36 v16.99,8.36 | v32.79,15.06 32.79,13.24 v32.85,13.18
  Bottom 0.203: 32.9,15.06 32.94,15.1 33.18,15.1 | 33.18,15.1 39.72,15.1 41.66,17.03 41.66,17.84 42.61,18.8 42.61,22.4 41.51,23.5 41.51,27.05 v42.78,28.32 42.78,33.07 43.84,34.13 51.82,34.13 J2.2 | 33.18,15.1 33.14,15.06 v32.79,15.06 | v32.85,13.18 32.85,12.78 33.73,11.9 33.73,11.89 34.55,11.08 34.55,8.57 35.92,7.19 35.92,5.69 35.44,5.21 31.81,5.21 31.02,6 26.41,6 24.89,7.52 22.01,7.52 21.61,7.92 17.42,7.92 v16.99,8.36
PA10/RXD1  (via drill 0.3, 0.35)
  Top 0.203: 41.64,29.79 U2.54 | v41.77,28.45 41.77,29.67 U2.54 | U2.54 41.55,33.24 v41.82,33.5 | U8.31 18.32,8.66 v18.16,8.51 | v31.96,13.26 32.21,13.51 32.21,15.59 v32.37,15.75
  Bottom 0.203: v32.37,15.75 39.61,15.75 41.3,17.44 41.3,18.16 42.19,19.05 42.19,22.14 41,23.32 41,27.69 v41.77,28.45 | v31.96,13.26 31.96,13.24 31.96,13.16 34.19,10.93 34.19,8.42 35.57,7.04 35.57,5.84 35.29,5.56 34.13,5.56 34.12,5.57 31.95,5.57 31.17,6.35 26.56,6.35 25.04,7.87 22.16,7.87 21.53,8.51 v18.16,8.51 | J2.3 49.63,34.49 42.8,34.49 v41.82,33.5
PA11/USB_D_N
  Top 0.203: J9.2 4.64,10.56 4.95,10.25 9.06,10.25 9.08,10.26 12.38,10.26 14.96,7.69 18.37,7.69 18.82,8.13 U8.32
PA12/USB_D_P
  Top 0.203: 3.31,9.91 J9.3 4.53,9.91 4.55,9.89 8.57,9.89 | 8.57,9.89 | 8.57,9.89 12.25,9.89 14.81,7.33 18.54,7.33 19.32,8.11 U8.33
PA13/SWDIO  (via drill 0.35)
  Top 0.203: 19.82,9.65 19.81,9.63 | v57.29,1.08 42.48,1.08 42.1,1.46 42.1,2.95 41.46,3.58 35.19,3.58 34.53,2.92 34.53,1.84 33.93,1.23 30.53,1.23 30.53,1.21 20.64,1.21 19.82,2.04 19.82,9.23 | 19.82,9.65 U8.34 | 19.82,9.22 19.82,9.23 | 19.82,9.23 19.82,9.65
  Bottom 0.203: CN2.2 58.1,7.54 57.29,6.73 v57.29,1.08
PA14/SWCLK  (via drill 0.35)
  Top 0.203: CN2.4 61.02,8.46 56.68,8.46 v55.76,9.37 | v38.92,8.87 39.33,8.87 39.52,8.67 39.52,6.93 39.3,6.72 35.07,6.72 v34.99,6.8 | U8.37 22.03,11.02 v22.09,10.8
  Bottom 0.203: v38.92,8.87 39.02,8.97 55.36,8.97 v55.76,9.37 | v34.99,6.8 34.75,7.03 33.42,7.03 32.49,7.96 30.38,7.96 30.2,7.78 28.7,7.78 25.68,10.8 v22.09,10.8
PA15  (via drill 0.35)
  Top 0.203: J8.1 55.37,5.61 44.43,5.61 v43.95,6.1 | 25.82,7.18 U9.12 26.07,7.14 26.07,5.41 | U8.38 21.51,11.51 22.49,11.51 22.85,11.15 23.58,11.15 23.91,10.82 23.91,5.94 24.46,5.38 26.04,5.38 26.07,5.41 | 26.07,5.41 26.65,4.83 v27.13,4.32
  Bottom 0.203: J8.1 58.5,2.38 | v43.95,6.1 42.17,6.1 42.05,5.97 42.05,1.63 41.61,1.19 31.73,1.19 31.38,1.55 31.38,3.63 30.43,4.58 27.38,4.58 v27.13,4.32
PB1  (via drill 0.35)
  Top 0.203: U8.19 14.21,13.52 13.3,14.43 12.13,14.43 v11.79,14.08
  Bottom 0.203: J8.10 33.73,4.4 31.61,4.4 30.72,5.29 25.75,5.29 25.4,4.93 14.48,4.93 14.21,5.21 14.21,8.76 12.19,10.78 12.19,12.45 11.79,12.85 v11.79,14.08
PB2  (via drill 0.35)
  Top 0.203: v13.08,13.6 13.62,13.6 14.21,13.02 U8.20
  Top 0.254: D1.1 35.79,14.49 v35.8,14.32
  Bottom 0.203: J2.1 58.61,37.29 55.08,33.76 45.86,33.76 43.93,31.83 43.93,15.24 43.01,14.33 35.83,14.33 | 31.59,20.03 31.43,20.03 | 33.53,20.04 33.13,20.45 31.85,20.45 31.63,20.23 | 31.63,20.23 31.43,20.03 | 31.63,20.23 31.66,20.19 31.66,14.99 32.31,14.33 35.83,14.33 | 31.43,20.03 29.89,18.49 20.57,18.49 19.14,17.05 19.14,14.38 18.79,14.03 13.51,14.03 v13.08,13.6 | v35.8,14.32 35.82,14.32 35.83,14.33
  Bottom 0.254: J7.2 33.53,20.04
PB3/SCK1-3/SDA2/SWO  (via drill 0.35)
  Top 0.203: v41.03,21.41 41.03,16.56 42.79,14.8 56.12,14.8 v56.65,14.28 | v21.71,17.43 22.67,18.39 v22.67,19.25 | v23.81,11.76 22.75,11.76 22.49,12.02 U8.39
  Bottom 0.203: v56.65,14.28 61.53,14.28 61.81,14 61.81,8.03 CN2.6 62.29,8.05 61.5,8.84 57.08,8.84 55.51,7.26 55.51,4.36 J8.3 | v41.03,21.41 39.1,23.34 32.37,23.34 31.4,22.38 25.64,22.38 v22.67,19.25 | 23.88,11.82 v23.81,11.76 21.53,11.76 20.89,12.39 20.89,16.73 21.59,17.43 v21.71,17.43
PB4/SDA3/MISO1-3  (via drill 0.35)
  Top 0.203: D1.6 v36.29,12.05 | v26.7,12.8 26.82,12.92 28.22,12.92 28.22,12.91 30.1,12.91 31.35,11.66 33.16,11.66 34.76,10.06 v35.69,10.06 | U8.40 23.1,12.52 v23.19,12.42
  Top 0.254: v36.29,12.05 37.19,12.95 37.19,14.99 v35.67,16.51
  Bottom 0.203: v26.7,12.8 26.32,12.42 v23.19,12.42 | 36.2,10.08 36.2,11.96 v36.29,12.05 | 36.2,10.08 36.2,7.95 37.43,6.73 37.43,6.06 37.44,6.04 37.44,3.22 J8.9 | 36.2,10.08 36.19,10.06 v35.69,10.06
  Bottom 0.254: 39.1,19.05 38.97,18.92 | 39.07,18.92 38.97,18.92 | J7.7 39.01,18.89 38.97,18.92 | v35.67,16.51 38.21,16.51 38.97,17.27 38.97,18.82 J7.7 | J7.7 39.07,18.92 | 39.07,18.92 39.1,18.92
PB5/MOSI1-3  (via drill 0.35)
  Top 0.203: v34.3,12.82 34.29,12.84 D1.3 34.29,14.12 34.04,14.37 34.04,17.05 v33.82,17.27 | v27.31,13.77 27.34,13.74 27.91,13.74 28.02,13.75 29.73,13.75 v30.68,14.71 | v24.57,13.18 22.85,13.18 22.68,13.02 U8.41
  Bottom 0.203: 34.65,18.92 34.65,18.91 | 34.65,18.91 J7.3 34.63,18.09 v33.82,17.27 34.65,18.11 34.65,18.91 | v27.31,13.77 26.96,13.41 26.31,13.41 26.08,13.18 v24.57,13.18 | v30.68,14.71 31.31,14.71 32.18,13.84 33.28,13.84 v34.3,12.82 34.3,12.8
PB6/MPU_SCL1  (via drill 0.3, 0.35)
  Top 0.203: v27.06,17.32 27.06,17.38 27.92,18.24 R9.2 29.47,19.48 29.47,22.24 v30.46,23.24 | v26.5,15.65 26.5,14.33 v26.22,14.05 26.09,13.92 26.09,11.56 v25.89,11.52 | U9.23 29.59,9.18 29.35,8.95 28.45,8.95 v27.95,9.45 | U8.42 22.68,13.52 23.16,14 v25.05,14
  Bottom 0.203: v26.22,14.05 26.17,14 v25.05,14 | v27.06,17.32 26.5,16.76 v26.5,15.65 | v30.46,23.24 30.46,27.41 37.9,34.84 47.45,34.84 J2.4 | v25.89,11.52 25.89,11.51 v27.95,9.45
PB7/MPU_SDA1  (via drill 0.35)
  Top 0.203: v28.79,9.53 28.79,9.6 28.87,9.68 U9.24 | R11.2 28.38,15.19 v28.38,14.38 | U8.43 22.67,14.02 23.56,14.9 v24.55,14.9
  Bottom 0.203: v24.55,14.9 24.59,14.94 26.63,14.94 27.2,14.38 v28.38,14.38 28.79,13.97 v28.79,9.53
PB8/SCL1-3  (via drill 0.35)
  Top 0.203: J3.2 47.1,8.13 v41.18,8.13 | v37.8,8.18 37.83,8.15 | 37.83,8.15 38.57,7.42 R16.2 | 37.83,8.15 37.83,8.05 37.71,8.18 | 37.57,8.32 37.71,8.18 | v30.23,11.97 30.73,11.46 30.73,8.53 30.94,8.32 31.45,8.32 31.48,8.29 37.69,8.29 v37.8,8.18 | U8.45 22.65,15.02 22.78,15.15 22.8,15.15 23.88,16.23 27.02,16.23 27.35,15.9 v27.35,15.2 | v37.8,8.18 37.71,8.18
  Bottom 0.203: v41.18,8.13 41.13,8.18 v37.8,8.18 | v27.35,15.2 28.79,15.2 29.52,14.47 29.52,12.68 v30.23,11.97
PB9/SDA1-2  (via drill 0.35)
  Top 0.203: J3.1 43.95,6.86 R18.2 | 33.13,12.19 33.65,11.67 | U8.46 22.27,15.52 22.28,15.5 22.65,15.5 23.74,16.59 27.32,16.59 27.97,15.94 30.43,15.94 31.38,14.99 31.38,14.67 31.38,13.02 32.21,12.19 33.13,12.19 | 33.65,11.67 33.13,12.19 | 33.13,12.19 | v37.63,10.16 37.09,10.7 34.63,10.7 33.65,11.67
  Bottom 0.203: v37.63,10.16 37.08,9.61 37.08,8.08 38.3,6.86 J3.1
PB10/SCK2/SCL2  (via drill 0.35)
  Top 0.203: J8.2 56.07,3.41 54.36,5.11 51.75,5.11 51.72,5.08 43.87,5.08 42.73,6.22 33.84,6.22 v33.61,6.45 | U8.21 13.92,12.52 13.65,12.24 v13.5,12.24
  Bottom 0.203: v33.61,6.45 33.5,6.45 32.34,7.61 30.53,7.61 30.34,7.42 28.46,7.42 26.69,9.19 25.75,10.13 21.2,10.13 18.84,12.49 13.75,12.49 v13.5,12.24
PB12  (via drill 0.3, 0.35)
  Top 0.203: 2.02,18.52 2.55,18.52 R10.1 | 2.02,18.52 1.3,18.52 R2.2 | v2.02,19.23 2.02,18.52 | J8.8 40.83,1.74 39.94,0.85 17.52,0.85 15.88,2.49 15.88,4.6 v14.97,5.51 | 14.11,10.29 12.86,10.29 12.48,10.67 6.13,10.67 v5.95,10.85 | 15.18,10.29 15.27,10.29 U8.25 15.32,10.15 15.18,10.29 | 15.18,10.29 14.11,10.29 | v14.03,10.24 14.06,10.24 14.11,10.29
  Bottom 0.203: v2.02,19.23 2.02,18.52 1.66,18.16 C18.1 2.33,17.46 2.33,17.12 2.36,17.1 2.36,11.52 2.75,11.12 5.67,11.12 v5.95,10.85 | v14.03,10.24 14.56,9.71 14.56,5.92 v14.97,5.51
PB13/SCK2  (via drill 0.35)
  Top 0.203: 35.06,12.47 35.05,12.46 | 35.12,12.54 35.06,12.47 | D1.5 35.04,11.76 v35.06,11.74 35.06,12.13 | 34.95,4.49 v34.91,4.47 35.44,3.94 39.58,3.94 41.8,3.94 42.43,3.3 42.44,3.3 J8.7 | v15.17,9.42 15.4,9.65 15.54,9.65 15.82,9.93 U8.26 | 35.06,12.47 35.06,12.13 | 36.57,13.22 36.57,14.53 34.76,16.34 34.76,17.27 33.11,18.92 32.83,18.92 31.73,20.02 v31.73,21.08 | 35.04,12.45 35.04,12.15 35.06,12.13
  Top 0.254: 35.04,12.45 35.12,12.54 35.42,12.83 36.18,12.83 36.57,13.22
  Bottom 0.203: 34.48,4.5 34.5,4.47 34.76,4.47 34.81,4.42 | 34.81,4.42 34.95,4.42 v34.91,4.47 34.94,4.5 | 34.88,4.5 34.94,4.5 | 34.94,4.5 35.48,4.5 36.28,5.3 36.28,7.34 36.26,7.36 36.26,7.39 35.06,8.6 v35.06,11.74 | 34.88,4.5 34.81,4.42 | v15.17,9.42 14.92,9.17 14.92,8.1 15.67,7.36 15.67,5.67 15.95,5.39 25.35,5.39 25.61,5.64 30.87,5.64 31.76,4.75 34.22,4.75 34.48,4.5 | 34.48,4.5 34.88,4.5
  Bottom 0.254: 36.43,20.57 36.81,20.19 36.81,18.91 J7.5
  Bottom 0.305: 36.43,20.57 35.92,21.08 v31.73,21.08
PB14/MISO2  (via drill 0.35)
  Top 0.203: J8.6 44.53,3.76 43.58,3.76 43.05,4.29 36.41,4.29 35.65,5.05 33.71,5.05 32.24,3.58 26.38,3.58 25.67,4.3 21.28,4.3 20.56,5.02 v20.56,6.52 | U8.27 16.32,9.92 15.83,9.43 15.83,8.96 v15.55,8.68
  Bottom 0.203: v20.56,6.52 19.85,7.54 16.69,7.54 v15.55,8.68
PB15/MOSI2  (via drill 0.35)
  Top 0.203: J8.5 48.45,3.02 47.19,4.27 43.68,4.27 42.54,5.4 38.71,5.4 | 31.83,6.66 v31.81,6.67 31.81,6.12 32.53,5.4 38.71,5.4 | v38.67,5.03 38.67,5.37 38.71,5.4 | U8.28 16.82,9.88 16.55,9.62 v16.55,9.16
  Top 0.305: R5.1 39.61,29.97 40.88,28.7 40.88,22.99 45.01,18.85 v45.01,18.59
  Top 0.406: C4.1 R8.2 R5.1
  Bottom 0.203: v45.01,18.59 45.01,14.76 42.76,12.5 39.14,12.5 36.72,10.08 36.72,7.94 37.8,6.86 37.8,6.16 38.64,5.07 38.64,5.06 v38.67,5.03 | v16.55,9.16 16.75,8.97 17.55,8.97 17.67,9.09 21.53,9.09 22.39,8.23 25.18,8.23 26.65,6.76 28.11,6.76 28.17,6.71 31.77,6.71 v31.81,6.67
PBO  (via drill 0.35)
  Top 0.203: U8.18 14.22,14.02 13.45,14.78 11.54,14.78 11.53,14.77 9.9,14.77 v9.6,14.47
  Bottom 0.203: J8.11 33.21,3.24 32.4,4.04 31.47,4.04 30.58,4.93 25.9,4.93 25.54,4.58 14.34,4.58 13.85,5.06 13.85,7.62 13.45,8.03 10.27,8.03 9.03,9.27 9.03,13.89 v9.6,14.47
PC13/LED  (via drill 0.35)
  Top 0.203: 20.39,17.27 U8.2 20.32,18.3 20.32,18.86 21.58,20.12 v22.18,20.12 | v26.29,24.08 26.77,23.59 Q1.1
  Bottom 0.203: J2.5 45.26,35.2 37.75,35.2 29.24,26.69 28.5,26.69 26.15,24.34 | v26.29,24.08 26.15,24.22 26.15,24.34 | v22.18,20.12 22.18,20.37 26.15,24.34
REGOUT
  Top 0.203: 25.01,8 C52.2 24.92,8.18 U9.10
SIM_CLK  (via drill 0.3)
  Top 0.203: v55.36,20.83 55.36,26.92 56.63,28.19 58.15,28.19 U2.41
  Bottom 0.203: v55.36,20.83 55.27,20.74 U4.3 48.56,20.7 46.97,20.7 46.58,21.09 D5.4
SIM_DATA  (via drill 0.3)
  Top 0.203: v56.37,22.1 56.37,25.02 57.13,25.78 U2.39
  Bottom 0.203: v56.37,22.1 56.28,22.01 U4.7 48.62,21.98 48.62,21.97 48.37,22.23 46.08,22.23 45.83,21.97 D5.5
SIM_RST  (via drill 0.3)
  Top 0.203: v54.59,23.37 54.59,27.05 55.99,28.45 55.99,29.84 U2.42
  Bottom 0.203: D5.3 48.5,23.38 U4.2 54.51,23.28 v54.59,23.37
SIM_VDD  (via drill 0.3)
  Top 0.203: v56.5,26.92 58.15,26.92 58.15,26.93 | 58.15,26.93 58.28,27.05 58.15,27.05 | U2.40 58.15,26.93
  Bottom 0.203: v56.5,26.92 55.4,25.82 U4.1 48.56,25.78 45.7,25.78 45.08,25.16 D5.1
VBAT  (via drill 0.35)
  Top 0.305: J6.1 6.49,31.22 6.49,31.85 6.1,32.23
  Top 0.406: 27.48,33.34 v27.42,33.27
  Top 0.813: IC1.3 27.48,33.34
  Top 1.27: SW1.COM1 21.07,38.48 20.3,37.72 17.64,37.72 15.46,39.9 9.99,39.9 9.87,39.78 6.35,39.78 5.44,38.87 5.44,35.05 6.49,34 6.49,31.22
  Bottom 0.813: v27.42,33.27 19.56,33.27 17.48,31.2 J6.1
  Bottom 1.27: 25.79,38.38 25.13,37.72 22.59,37.72 SW1.COM1
VBAT_IN  (via drill 0.35)
  Top 0.508: 25,35.31 25.03,35.28 v25.79,35.28 | R5.2 39.61,36.32 39.3,36.63 v34.65,36.63
  Top 0.813: SW1.CH1A 23.99,39.24 25,38.23 25,35.31 25,34.92 R17.1 23.31,34.04 Q2.3
  Bottom 0.508: v25.79,35.28 31.07,35.28 32.34,36.55 34.58,36.55 v34.65,36.63
VBUS
  Top 0.305: 7.27,12.68 FL3.2
  Top 0.406: D6.1 7.44,13.73 C41.2 7.3,12.7 7.27,12.68
VBUS_IN
  Top 0.305: 6.2,12.8 FL3.1
  Top 0.406: J9.1 5.3,11.21 5.3,13.47 C40.2 5.67,13.21 FL3.1 6.18,12.65
VCC
  Top 0.305: CHG.+ 29.07,38.61 29.07,40.33
  Top 0.406: J1.1 7.11,24.85 8.04,23.93 8.04,19.18 8.51,18.71 8.51,16.89 D6.3 | SW1.COM2 22.26,37.39 22.26,39.7 22.89,40.33 29.07,40.33 31.81,40.33 | C9.2 33.46,32.51 | 33.46,32.51 31.48,32.51 31,32.99 IC1.4 | 31.78,40.3 31.81,40.33 | 31.81,40.33 34.48,40.33 35.75,39.07 J2.10 35.35,37.99 34.97,37.99 33.46,36.47 33.46,32.51
  Bottom 0.406: J1.1 3.87,27.47 3.87,30.39 6.27,32.79 15.43,32.79 17.53,34.9 19.77,34.9 SW1.COM2
VIN  (via drill 0.35)
  Top 0.254: C8.2 36.18,28.47 D3.C 34.15,30.73 33.26,31.62
  Top 0.305: C8.2 C12.2 36.18,21.08 C16.A
  Top 0.406: U5.8 20.57,30.36 20.57,31.62 | 20.57,31.62 Q2.2 | 33.26,31.62 24.11,31.62 | 24.11,31.62 22.84,31.62 | 22.84,31.62 v21.8,31.62 20.57,31.62 | 24.11,31.62 R17.2 C17.2 | C10.2 24.11,30.23 24.11,31.62 | U5.5 22.84,30.63 22.84,31.62 | v6.99,20.12 6.99,18.77 R1.2 | C16.A 36.3,17.93 38.06,16.18 U2.11 U2.12 40.85,14.98 42.4,13.44 55.59,13.44 57.98,11.05 L1.2
  Bottom 0.406: v21.8,31.62 19.64,31.62 18.22,30.2 8.54,30.2 8.31,29.97 8.31,21.51 6.99,20.19 v6.99,20.12
VIO  (via drill 0.3)
  Top 0.305: R14.2 v46.12,32.13 | v54.72,28.32 54.72,29.85 U2.43
  Bottom 0.203: v46.12,32.13 53.58,32.13 54.31,31.4
  Bottom 0.305: 54.31,31.4 54.72,30.99 v54.72,28.32
VREF
  Top 0.203: C58.2 15.5,19.86 C59.2 15.71,19.66 FL4.2 16.61,19.54 16.61,18.93 16.82,18.72 U8.9
VSYS  (via drill 0.35)
  Top 0.203: 19.16,29.72 | v19,29.72 18.78,29.5 18.78,29.34
  Top 0.305: 23.99,36.83 24.04,36.83
  Top 0.406: 3.69,17.5 3.69,25.5 | 3.69,25.5 3.69,25.76 5.09,27.15 | 21.83,34.42 21.76,34.35 Q2.1 19.16,32.94 19.16,30.07 19.16,29.72 18.88,29.6 18.88,33.63 19.87,34.62 21.42,34.62 22.67,35.87 22.67,36.47 23.2,37.01 23.91,37.01 | R15.1 26.4,30.1 | SW1.CH2A 21.83,34.42 | 21.83,34.42 20.56,34.42 19.16,33.02 | R10.2 3.06,16.87 3.69,17.5 | 30.7,29.97 D2.A | 2.42,17.14 3.03,17.14 3.59,17.7 3.59,19.23 3.26,19.56 3.26,26.01 4.94,27.69 7.25,27.69 6.97,27.41 | 23.91,37.01 24.04,36.88 24.04,36.83 24.04,36.6 21.47,34.04 20.41,34.04 | 5.83,27.64 3.69,25.5 | 3.69,25.5 3.49,25.5 | 3.49,25.5 3.49,19.56 | 3.49,25.5 3.49,25.91 4.99,27.41 | 18.98,33.27 20.07,34.37 21.5,34.37 23.83,36.7 23.45,36.7 | 23.45,36.7 23.38,36.78 23.38,36.65 22.82,36.09 22.82,36.12 | 22.49,35.28 23.4,35.28 24.04,35.92 24.04,36.78 23.99,36.83 23.99,36.25 23.25,35.51 | 2.47,17.12 2.42,17.07 2.42,16.54 2.47,16.48 3.26,16.48 3.69,16.92 3.69,17.2 | 3.69,17.5 3.69,17.2 | 3.69,17.2 3.21,16.71 | 5.83,27.64 10.42,27.64 | 4.99,27.41 6.97,27.41 | 6.97,27.41 10.19,27.41 10.42,27.64 | 5.83,27.64 5.22,27.64 4.99,27.41 | SW1.CH2A 23.61,36.7 23.91,37.01 | SW1.CH2A 23.61,36.55 23.45,36.7 | 10.42,27.64 11.15,28.37 17.81,28.37 18.78,29.34 19.16,29.72
  Top 0.61: 26.4,30.1 v25.64,30.1
  Top 1.016: R15.1 30.7,29.97
  Bottom 1.016: v25.64,30.1 25.26,29.72 v19,29.72

## Text on the board
tPlace: +3V3 | TXD | GND | PA0 | PA1 | PC13 | NRST | VCC | +3V3 | PB6 | PA10 | PA9 | PB2 | RXD | GND | OFF | ON | VBAT | + | TXD2 | HRX | HTX | GND | - | RXD2 | GND | + | - | CHG | STM32F411CEU6 | CLK | LM1117IMPX-5.0 | USB | DC 6V-12V | SDA | SCL | 3V3 | GND | SWO | RST | + | - | SWDIO | +3V3V | PB14 | GND | PB0 | PB1 | PB4 | PB12 | PB13 | PB15 | PA8 | PB3 | PB10 | PA15 | - | + | SPI1_MOSI | SPI1_MISO | SPI1_SCK | SPI1_CS
bNames: Pronto Micro-Sysytems Technology Limited | Pro-Tracker v2.5 | www.pmtl.ng | A9 | A9G | STM32